# EAGLE design CLK (EAGLE 9.6.2)
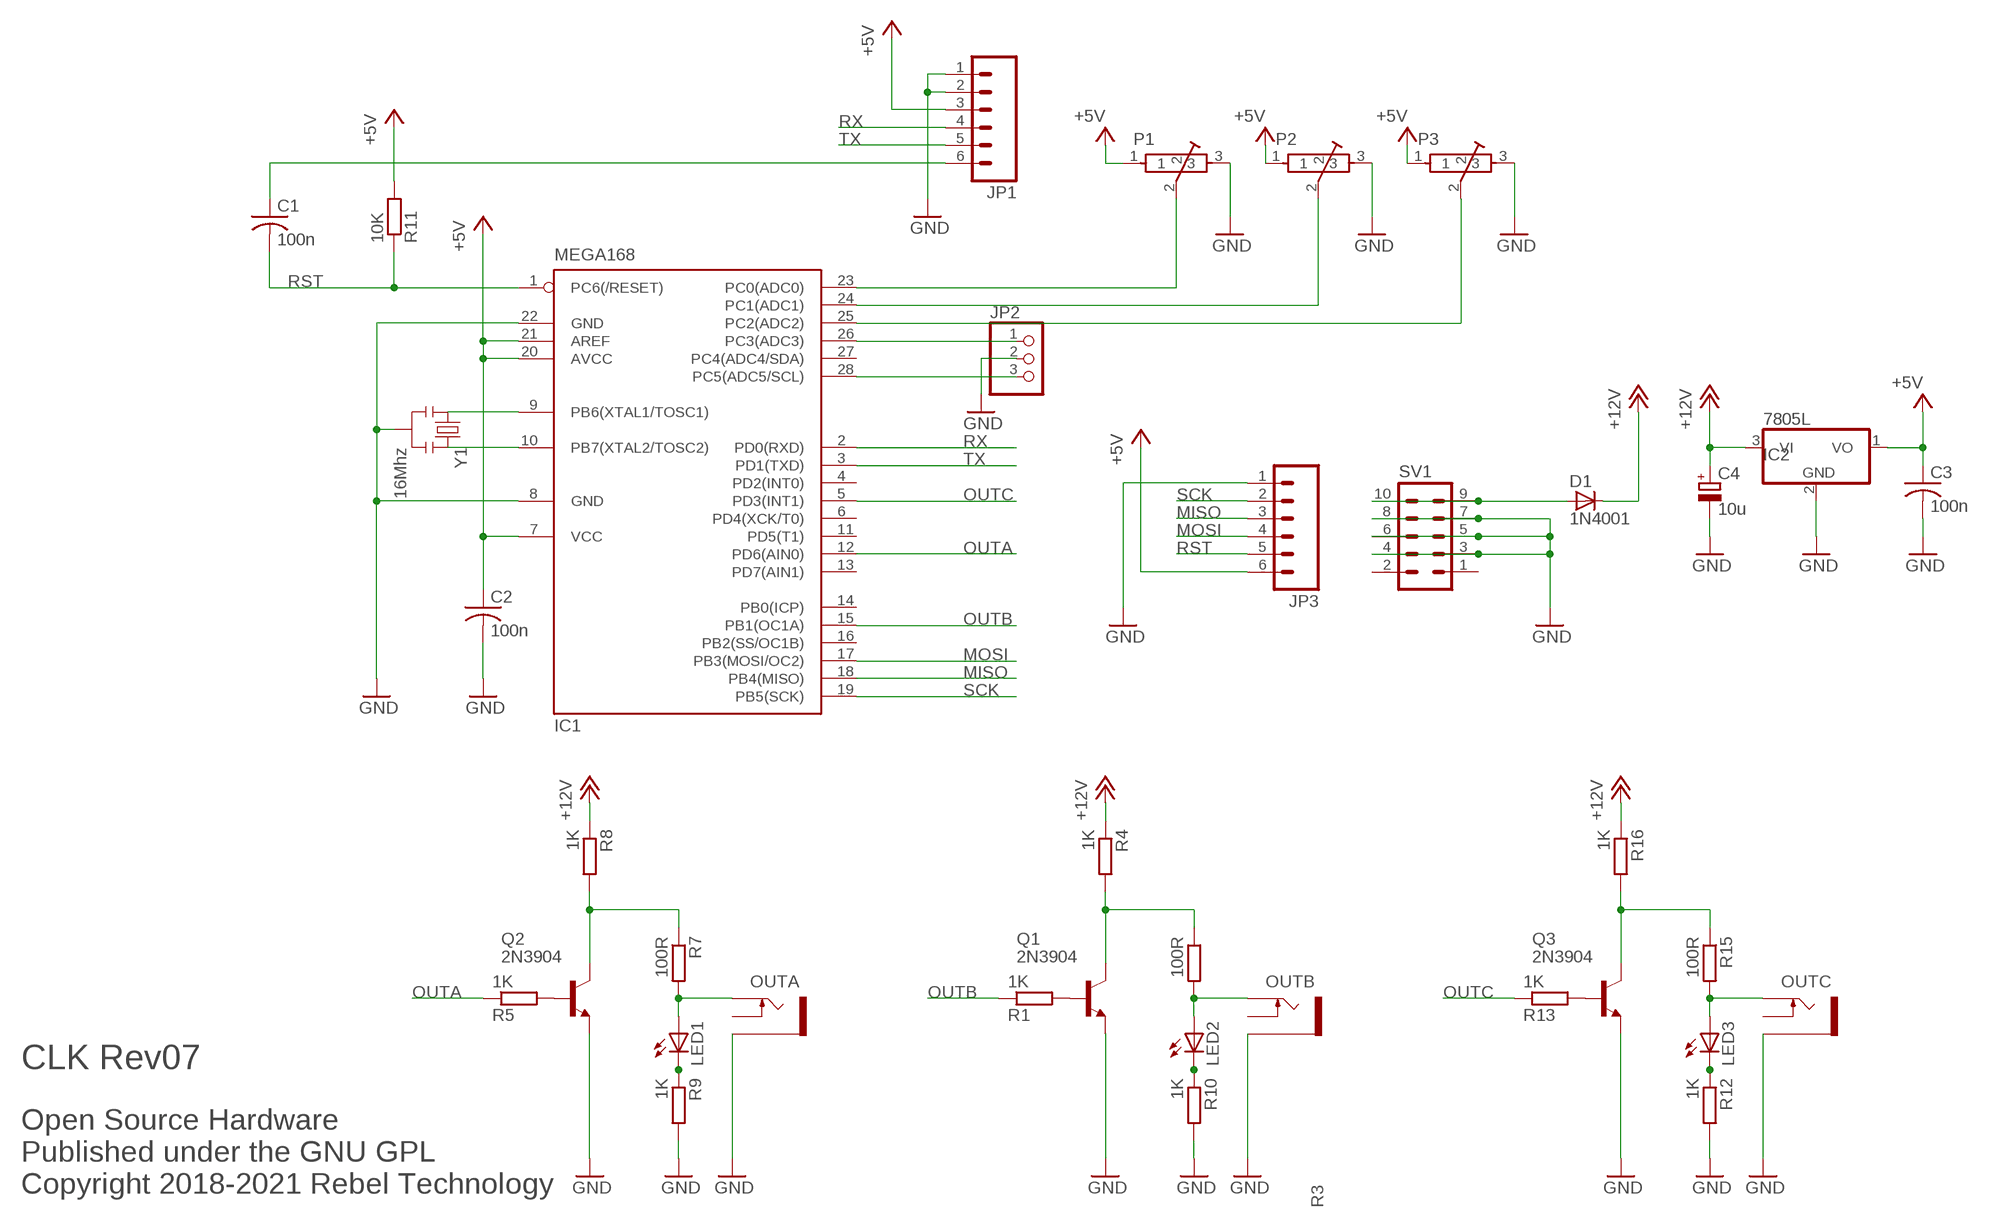
[diagram p0: schematic, sheet 1]

## Parts
C1  100n  C-US050-024X044  [C050-024X044]
C2  100n  C-US050-024X044  [C050-024X044]
C3  100n  C-US050-024X044  [C050-024X044]
C4  10u  CPOL-EUE5-6  [E5-6]
D1  1N4001  DIODE1N4001  [DIODE-1N4001]
IC1  MEGA168  MEGA8-P  [DIL28-3]
IC2  7805L  [TO92]
JP1  M06SIP  [1X06]
JP2  PINHD-1X3  [1X03]
JP3  M06SIP  [1X06]
LED1  LED3MM  [LED3MM]
LED2  LED3MM  [LED3MM]
LED3  LED3MM  [LED3MM]
OUTA  PJ302M  [PJ302M]
OUTB  PJ302M  [PJ302M]
OUTC  PJ302M  [PJ302M]
P1  POT-BOURNS-PTD901  [POT-BOURNS-PTD901]
P2  POT-BOURNS-PTD901  [POT-BOURNS-PTD901]
P3  POT-BOURNS-PTD901  [POT-BOURNS-PTD901]
Q1  2N3904  [TO92]
Q2  2N3904  [TO92]
Q3  2N3904  [TO92]
R1  1K  R-EU_0204/7  [0204/7]
R3  100R  R-EU_0204/7  [0204/7]
R4  1K  R-EU_0204/7  [0204/7]
R5  1K  R-EU_0204/7  [0204/7]
R7  100R  R-EU_0204/7  [0204/7]
R8  1K  R-EU_0204/7  [0204/7]
R9  1K  R-EU_0204/7  [0204/7]
R10  1K  R-EU_0204/7  [0204/7]
R11  10K  R-EU_0204/7  [0204/7]
R12  1K  R-EU_0204/7  [0204/7]
R13  1K  R-EU_0204/7  [0204/7]
R15  100R  R-EU_0204/7  [0204/7]
R16  1K  R-EU_0204/7  [0204/7]
SV1  MA05-2  [MA05-2]
Y1  16Mhz  RESONATORPTH  [RESONATOR-PTH]

## Nets
+5V: C2.1 C3.1 IC1.7(VCC) IC1.20(AVCC) IC1.21(AREF) IC2.1(VO) JP1.3 JP3.6 P1.1 P2.1 P3.1 R11.2
+12V: C4.+ D1.C IC2.3(VI) R4.1 R8.1 R16.1
ADC0: IC1.23(PC0(ADC0)) P1.2
ADC1: IC1.24(PC1(ADC1)) P2.2
ADC2: IC1.25(PC2(ADC2)) P3.2
GND: C2.2 C3.2 C4.- IC1.8(GND) IC1.22(GND) IC2.2(GND) JP1.1 JP1.2 JP2.2 JP3.1 OUTA.GND(SLEEVE) OUTB.GND(SLEEVE) OUTC.GND(SLEEVE) P1.3 P2.3 P3.3 Q1.3(E) Q2.3(E) Q3.3(E) R9.2 R10.2 R12.2 SV1.3 SV1.4 SV1.5 SV1.6 SV1.7 SV1.8 Y1.2
MISO: IC1.18(PB4(MISO)) JP3.3
MOSI: IC1.17(PB3(MOSI/OC2)) JP3.4
N$3: LED3.K(C) R12.1
N$7: IC1.9(PB6(XTAL1/TOSC1)) Y1.1
N$8: IC1.10(PB7(XTAL2/TOSC2)) Y1.3
N$11: IC1.28(PC5(ADC5/SCL)) JP2.3
N$13: LED2.A OUTB.TIP R3.2
N$14: Q1.1(C) R3.1 R4.2
N$15: IC1.26(PC3(ADC3)) JP2.1
N$21: Q1.2(B) R1.2
N$22: Q3.2(B) R13.2
N$23: LED3.A OUTC.TIP R15.2
N$24: Q3.1(C) R15.1 R16.2
N$25: Q2.2(B) R5.2
N$26: LED1.A OUTA.TIP R7.2
N$27: Q2.1(C) R7.1 R8.2
N$28: LED1.K(C) R9.1
N$29: C1.1 JP1.6
N$30: LED2.K(C) R10.1
N$45: D1.A SV1.9 SV1.10
OUTA: IC1.12(PD6(AIN0)) R5.1
OUTB: IC1.15(PB1(OC1A)) R1.1
OUTC: IC1.5(PD3(INT1)) R13.1
RST: C1.2 IC1.1(PC6(/RESET)) JP3.5 R11.1
RX: IC1.2(PD0(RXD)) JP1.4
SCK: IC1.19(PB5(SCK)) JP3.2
TX: IC1.3(PD1(TXD)) JP1.5
Unconnected: IC1.4(PD2(INT0)) IC1.6(PD4(XCK/T0)) IC1.11(PD5(T1)) IC1.13(PD7(AIN1)) IC1.14(PB0(ICP)) IC1.16(PB2(SS/OC1B)) IC1.27(PC4(ADC4/SDA)) OUTA.SW(SWITCH) OUTB.SW(SWITCH) OUTC.SW(SWITCH) SV1.1 SV1.2

## Notes on the sheet
- CLK Rev07
- Open Source Hardware
  Published under the GNU GPL
  Copyright 2018-2021 Rebel Technology

## Library data of the parts
C1-C3 = rcl:C-US: CAPACITOR, American symbol
C4 = rcl:CPOL-EU: POLARIZED CAPACITOR, European symbol
D1 = Rebel:DIODE: Diode These are standard reverse protection diodes and small signal diodes. SMA package can handle up to about 1A. SOD-323 can handle about 200mA. Watch the SOD-323 package when ordering, there are some mfgs out there that are 5-pin packages.
IC1 = atmel:MEGA8-P: MICROCONTROLLER 8 Kbytes FLASH, 1 kbytes SRAM, 512 bytes EEPROM, USART, 4-channel 10 bit ADC, 2-channel 8 bit ADC Pin compatible with Atmega48, ATMega88, ATMega168 Source: avr.lbr; OC_FARNELL: unknown; OC_NEWARK: unknown
IC2 = linear:78*: Positive VOLTAGE REGULATOR Source: http://cache.national.com/ds/LM/LM78L05.pdf http://www.fairchildsemi.com/ds/LM/LM7805.pdf
JP1 JP3 = SparkFun:M06: Header 6 Standard 6-pin 0.1" header. Use with straight break away headers (SKU : PRT-00116), right angle break away headers (PRT-00553), swiss pins (PRT-00743), machine pins (PRT-00117), and female headers (PRT-00115). Molex polarized connector foot print use with SKU : PRT-08094 with associated crimp pins and housings. NOTES ON THE VARIANTS LOCK and LOCK_LONGPADS... This footprint was designed to help hold the alignment of a through-hole component (i.e. 6-pin header) while soldering it into place. You may notice that each hole has been shifted either up or down by 0.005 of an inch from it's more standard position (which is a perfectly straight line). This slight alteration caused the pins (the squares in the middle) to touch the edges of the holes. Because they are alternating, it causes a "brace" to hold the component in place. 0.005 has proven to be the perfect amount of "off-center" position when using our standard breakaway headers. Although looks a little odd when you look at the bare footprint, once you have a header in there, the alteration is very hard to notice. Also, if you push a header all the way into place, it is covered up entirely on the bottom side. This idea of altering the position of holes to aid alignment will be further integrated into the Sparkfun Library for other footprints. It can help hold any component with 3 or more connection pins.
JP2 = pinhead:PINHD-1X3: PIN HEADER
LED1-LED3 = Rebel:LED: LED
OUTA OUTB OUTC = pj302m:PJ302M: PJ302M horizontal / right angled mount 3.5 mm jack socket
P1-P3 = Rebel:POT-BOURNS-PTD901
Q1-Q3 = transistor-npn:2N3904: NPN Transistor
R1 R3-R5 R7-R13 R15 R16 = rcl:R-EU_: RESISTOR, European symbol
SV1 = Rebel:MA05-2: PIN HEADER; OC_FARNELL: unknown; OC_NEWARK: unknown
Y1 = SparkFun:RESONATOR: Resonator Small SMD resonator. This is the itty bitty 10/20MHz resonators with built in caps. CSTCE10M0G55 and CSTCE20M0V53. Footprint has been reviewed closely but hasn't been tested yet.

## Board
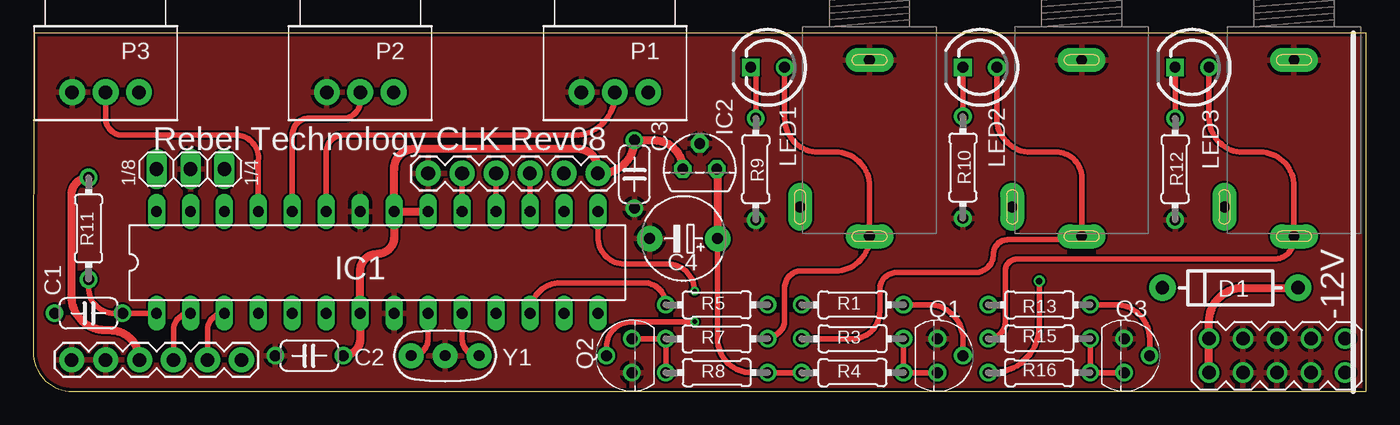
[diagram p1: board, top side]
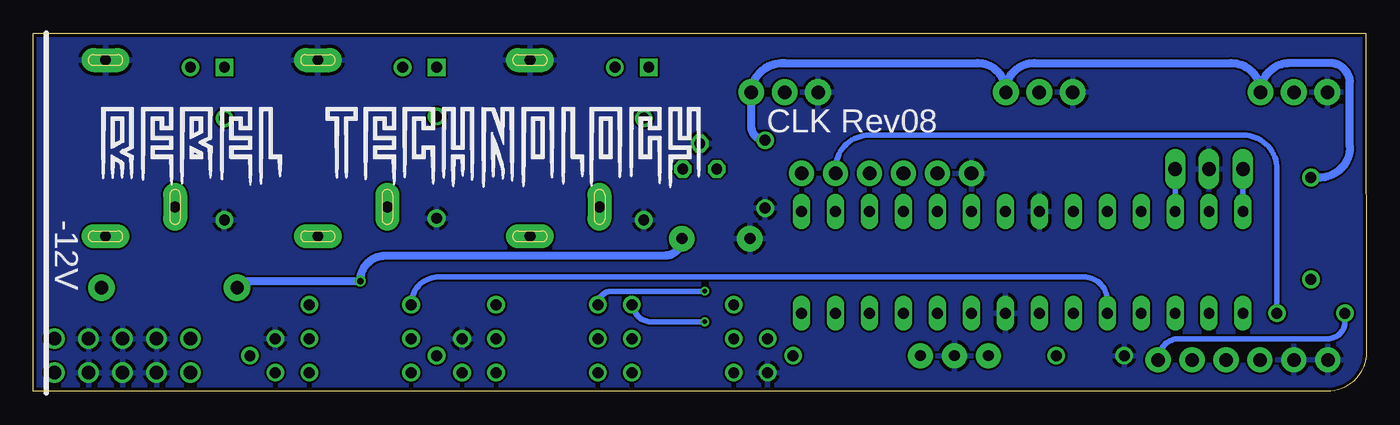
[diagram p2: board, bottom side, seen from below]

Size 99.69 x 26.81 mm. Coordinates in mm from the lower left corner, seen from the top.
Outline: 99.69,26.81 0.01,26.81 0,2.68 arc90 3.17,0.01 99.69,0.01 99.69,26.81
Copper layers (1*16): Top 0.035mm / dielectric 1.5mm / Bottom 0.035mm
Design rules "SeeedStudio_2layer_DRU_no_angle_20140221": minimum track width 6mil, minimum drill 12mil, track to track 6mil, track to pad 6mil, pad to pad 6mil, via to via 6mil, smd to smd 0mil, copper to edge 10mil, drill to drill 10mil, minimum pad ring 10mil, minimum via ring 6mil, stop-mask expansion 2mil, vias tented up to drill 100mil, thermal gap 10mil

### Footprints (pad centres in the part's own frame; a part is rotated, then mirrored left to right if it is on the bottom)
C050-024X044 = drill 0.813: 1 -2.54,0; 2 2.54,0
E5-6 = drill 0.813 pad 1.905: + -2.54,0; - 2.54,0
DIODE-1N4001 = drill 1 pad 1.981: A -5.08,0; C 5.08,0
DIL28-3 = drill 0.813 long: 1 -16.51,-3.81; 2 -13.97,-3.81; 3 -11.43,-3.81; 4 -8.89,-3.81; 5 -6.35,-3.81; 6 -3.81,-3.81; 7 -1.27,-3.81; 8 1.27,-3.81; 9 3.81,-3.81; 10 6.35,-3.81; 11 8.89,-3.81; 12 11.43,-3.81; 13 13.97,-3.81; 14 16.51,-3.81; 15 16.51,3.81; 16 13.97,3.81; 17 11.43,3.81; 18 8.89,3.81; 19 6.35,3.81; 20 3.81,3.81; 21 1.27,3.81; 22 -1.27,3.81; 23 -3.81,3.81; 24 -6.35,3.81; 25 -8.89,3.81; 26 -11.43,3.81; 27 -13.97,3.81; 28 -16.51,3.81
TO92 = drill 0.813 octagon: 1 -1.27,0; 2 0,1.905; 3 1.27,0
1X06 = drill 1.016 pad 1.88: 1 0,0; 2 2.54,0; 3 5.08,0; 4 7.62,0; 5 10.16,0; 6 12.7,0
1X03 = drill 1.016 long: 1 -2.54,0; 2 0,0; 3 2.54,0
LED3MM = drill 0.813: A -1.27,0 | drill 0.813 square: K 1.27,0
PJ302M = drill 0.8 pad 1.8 long: GND 2.5,0; SW 13.5,-5.2; TIP 15.7,0
POT-BOURNS-PTD901 = drill 1 pad 1.93: 1 -2.5,-0.036; 2 0,-0.036; 3 2.5,-0.036
TO92' = drill 0.813: 1 1.27,0; 2 0,1.905; 3 -1.27,0
0204/7 = drill 0.813: 1 -3.81,0; 2 3.81,0
MA05-2 = drill 1.016: 1 -5.08,-1.27; 2 -5.08,1.27; 3 -2.54,-1.27; 4 -2.54,1.27; 5 0,-1.27; 6 0,1.27; 7 2.54,-1.27; 8 2.54,1.27; 9 5.08,-1.27; 10 5.08,1.27
RESONATOR-PTH = drill 0.8 pad 1.88: 1 -2.54,0; 2 0,0; 3 2.54,0

### Placement (x,y rotation side)
C1  4.13,5.85 0 top
C2  20.64,2.68 180 top
C3  44.96,16.27 270 top
C4  48.64,11.44 180 top
D1  89.53,7.76 180 top
IC1  25.72,9.66 0 top
IC2  49.85,16.65 0 top
JP1  2.86,2.36 0 top
JP2  11.75,16.65 180 top
JP3  29.53,16.33 0 top
LED1  54.93,24.27 180 top
LED2  70.8,24.27 180 top
LED3  86.68,24.27 180 top
OUTA  62.55,27.32 270 top
OUTB  78.42,27.32 270 top
OUTC  94.3,27.32 270 top
P1  43.5,22.36 180 top
P2  24.45,22.36 180 top
P3  5.4,22.36 180 top
Q1  2N3904  [TO92']  67.63,2.68 270 top
Q2  2N3904  [TO92']  44.77,2.68 90 top
Q3  2N3904  [TO92']  81.6,2.68 270 top
R1  61.28,6.49 0 top
R3  61.28,3.95 180 top
R4  61.28,1.41 0 top
R5  51.12,6.49 0 top
R7  51.12,3.95 0 top
R8  51.12,1.41 180 top
R9  54.04,16.65 270 top
R10  69.53,16.77 270 top
R11  4.13,12.2 90 top
R12  85.41,16.65 270 top
R13  75.25,6.49 0 top
R15  75.25,3.95 180 top
R16  75.25,1.41 0 top
SV1  93.03,2.68 180 top
Y1  30.8,2.68 0 top

### Tracks (layer width: path | path; a pad name or v marks a point on that pad's centre or on a via)
+5V  (via drill 0.35)
  Top 0.61: IC1.21 IC1.20 | JP1.3 arc90 5.72,4.58 5.4,4.58 arc-90 2.86,7.12 2.86,14.74 arc-90 R11.2 | IC1.21 26.99,11.57 arc-90 25.72,10.3 arc90 24.45,9.03 IC1.7 24.45,3.95 arc-90 C2.1 | IC1.21 26.99,16.65 arc-90 28.51,18.17 40.7,18.17 arc-90 42.23,16.65 JP3.6 42.48,16.33 arc90 C3.1 46.42,18.81 arc-90 IC2.1 | P2.1 v26.95,22.47
  Bottom 0.61: R11.2 3.49,16.01 arc-90 1.21,18.3 1.21,23.21 arc-90 2.86,24.58 5.71,24.58 arc-90 P3.1 arc-90 10.08,24.58 24.83,24.58 arc-90 v26.95,22.47 arc-90 29.07,24.58 43.49,24.58 arc-90 P1.1 46,19.85 arc-90 C3.1
+12V  (via drill 0.5)
  Top 0.406: R16.1 71.75,1.41 arc90 75.25,4.9 v75.25,8.27 | R4.1 R8.1 53.72,1.41 arc-90 51.18,3.95 C4.+
  Top 0.61: IC2.3 arc-90 51.18,16.58 C4.+
  Bottom 0.61: D1.C arc90 83.95,8.27 v75.25,8.27 arc90 73.34,10.17 52.45,10.17 arc-90 C4.+
ADC0
  Top 0.406: P1.2 43.5,22.24 arc-90 40.45,19.19 23.18,19.19 arc90 21.91,17.92 IC1.23
ADC1
  Top 0.406: P2.2 24.45,21.73 arc-90 23.18,20.46 20.64,20.46 arc90 19.37,19.19 IC1.24
ADC2
  Top 0.406: IC1.25 16.83,17.28 arc90 15.3,19.19 6.67,19.19 arc-90 5.4,20.46 P3.2
GND
  pour Bottom: 101.92,-4.94 -0.95,-4.94 -0.95,31.89 101.92,31.89
  pour Top: 101.92,-4.94 -2.22,-4.94 -2.22,31.89 101.92,31.89
MISO
  Top 0.406: IC1.18 JP3.3
MOSI
  Top 0.406: IC1.17 JP3.4
N$3
  Top 0.406: LED3.K R12.1
N$7
  Top 0.406: IC1.9 29.53,3.95 arc-90 Y1.1
N$8
  Top 0.406: IC1.10 32.07,3.95 arc90 Y1.3
N$11
  Bottom 0.406: IC1.28 JP2.3
N$13
  Top 0.406: R3.2 61.28,3.95 arc90 63.31,5.98 63.31,7.63 arc-90 64.58,8.9 70.42,8.9 arc90 71.82,10.3 arc-90 72.88,11.36 78.17,11.36 arc90 OUTB.TIP 78.42,16.01 arc90 76.52,17.92 74.61,17.92 arc-90 72.07,20.46 LED2.A
N$14
  Top 0.406: R3.1 R4.2 Q1.1
N$15
  Bottom 0.406: IC1.26 JP2.1
N$21
  Top 0.406: R1.2 66.99,6.49 arc-90 69.53,3.95 Q1.2
N$22
  Top 0.406: R13.2 80.96,6.49 arc-90 83.5,3.95 Q3.2
N$23
  Top 0.406: R15.2 arc90 72.71,5.22 72.71,9.03 arc-90 73.6,9.92 92.85,9.92 arc90 94.3,11.36 94.3,11.57 OUTC.TIP 94.3,15.38 arc90 91.76,17.92 90.49,17.92 arc-90 87.95,20.46 LED3.A
N$24
  Top 0.406: R15.1 R16.2 Q3.1
N$25  (via drill 0.35)
  Top 0.406: Q2.2 42.86,3.31 arc-90 44.77,5.22 v49.47,5.22
  Bottom 0.406: R5.2 54.8,6.49 arc-90 53.53,5.22 v49.47,5.22
N$26
  Top 0.406: R7.2 54.93,4.07 arc90 56.2,5.34 56.2,7.76 arc-90 57.47,9.03 60.01,9.03 arc90 62.55,11.57 OUTA.TIP 62.55,15.38 arc90 60.01,17.92 58.74,17.92 arc-90 56.2,20.46 LED1.A
N$27
  Top 0.406: R8.2 R7.1 Q2.1
N$28
  Top 0.406: LED1.K arc-90 54.04,23.89 R9.1
N$29
  Bottom 0.406: C1.1 1.59,5.22 arc90 2.86,3.95 13.97,3.95 arc-90 JP1.6
N$30
  Top 0.406: LED2.K R10.1
N$45
  Top 0.61: SV1.10 SV1.9 87.95,5.22 arc-90 90.49,7.76 D1.A
OUTA
  Top 0.406: IC1.12 arc-90 39.43,8.14 45.66,8.14 arc-90 R5.1
OUTB  (via drill 0.35)
  Top 0.406: IC1.15 42.23,11.57 arc90 44.26,9.54 47.43,9.54 arc-90 v49.47,7.5
  Bottom 0.406: v49.47,7.5 56.45,7.5 arc-90 R1.1
OUTC
  Bottom 0.406: IC1.5 19.37,6.81 arc-90 21.15,8.58 69.34,8.58 arc-90 R13.1
RST
  Top 0.406: IC1.1 C1.2 6.03,5.85 arc-90 4.13,7.76 R11.1
  Bottom 0.406: JP3.5 39.69,16.65 arc90 37.15,19.19 9.21,19.19 arc90 6.67,16.65 C1.2
RX
  Top 0.406: IC1.2 arc90 10.48,4.58 JP1.4
SCK
  Top 0.406: IC1.19 JP3.2
TX
  Top 0.406: IC1.3 arc90 13.02,4.58 JP1.5

### Text on the board
tPlace: Rebel Technology CLK Rev08 | 1/8 | 1/4 | -12V
bPlace: CLK Rev08 | -12V
tNames: Y1